# Altium project CH9329.PrjPcb
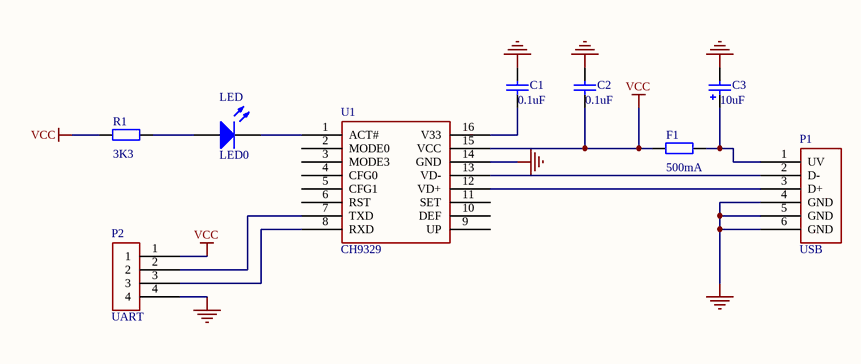
[diagram p0: Sheet1.SchDoc]
1 sheet, 9 parts. Net scope: global (net labels, ports and power ports of the same name join across sheets).
Board files: PCB1.PcbDoc, SOP-16_150MILCH9329.pcbdoc

## Sheet Sheet1.SchDoc
size A4; SheetNumber: 1; SheetTotal: 1; SPICEModelCacheZBBNYDDK: <root> / <DocumentId>ZBBNYDDK</DocumentId> / <CacheFrame Number="0"> / <Model Name="led0" Kind="MDL"> / <Text>*Typ INFRARED GaAs LED: Vf=1.2V Vr=5V If=40mA trr=3uS / *LED Pinout: 1=A, 2=K / .MODEL LED0 D (IS=93.5P RS=84M N=2.63 BV=5 IBV=10U / + CJO=2.97P VJ=.75 M=.333 TT=4.32U)</Text> / </Model> / </CacheFrame> / </root>

### Parts
C1  value 0.1uF  [RAD-0.3]  (hidden comment: Cap)
C2  value 0.1uF  [RAD-0.3]  (hidden comment: Cap)
C3  value 10uF  [POLAR0.8]  (hidden comment: Cap Pol2)
F1  value 500mA  [AXIAL-0.4]  (hidden comment: Res2)
LED  LED0  [LED-0]
P1  USB  [USB]
P2  UART  [UART]
R1  3K3  [AXIAL-0.4]
U1  CH9329  [CH9329]

### Nets
GND: C1.2 C2.2 C3.2 P1.4(GND) P1.5(GND) P1.6(GND) P2.4 U1.14(GND)
VCC: C2.1 F1.1 P2.1 R1.1 U1.15(VCC)
NetC1_1: C1.1 U1.16(V33)
NetC3_1: C3.1 F1.2 P1.1(UV)
NetLED_1: LED.1(A) R1.2
NetLED_2: LED.2(K) U1.1(ACT#)
NetP1_2: P1.2(D-) U1.13(VD-)
NetP1_3: P1.3(D+) U1.12(VD+)
NetP2_2: P2.2 U1.7(TXD)
NetP2_3: P2.3 U1.8(RXD)

Not connected (* = marked no-connect by the designer): U1 2(MODE0) 3(MODE3) 4(CFG0) 5(CFG1) 6(RST) 9(UP) 10(DEF) 11(SET)

### Library data of the parts
C1 C2 = Cap: Capacitor; Published: 8-Jun-2000; LatestRevisionDate: 17-Jul-2002; LatestRevisionNote: Re-released for DXP Platform.; PackageReference: RAD-0.3; Publisher: Altium Limited; PackageDescription: Radial Cap, Thru-Hole; 2 Leads; 0.3 in Pin Spacing
C3 = Cap Pol2: Polarized Capacitor (Axial); Published: 8-Jun-2000; LatestRevisionDate: 17-Jul-2002; LatestRevisionNote: Re-released for DXP Platform.; PackageReference: POLAR0.8; Publisher: Altium Limited; PackageDescription: Polarized Capacitor; 2 Leads
F1 R1 = Res2: Resistor; Published: 8-Jun-2000; LatestRevisionDate: 17-Jul-2002; LatestRevisionNote: Re-released for DXP Platform.; PackageReference: AXIAL-0.4; Publisher: Altium Limited; PackageDescription: Axial Device, Thru-Hole; 2 Leads; 0.4 in Pin Spacing
  R1: Value: 3K3
LED = LED0: Typical INFRARED GaAs LED; Published: 8-Jun-2000; LatestRevisionDate: 08-Jul-2005; LatestRevisionNote: Mech Layer 1 removed.; PackageReference: LED-0; Publisher: Altium Limited; PackageDescription: LED; 2 Leads
P2 = UART: 串口
U1 = CH9329: 主控